# Altium schematic sheet D5035-01.SchDoc: Sheet Description
size A3; Organization: Organization; Address1: Address1; Address2: Address2; Address3: Address3; Address4: Address4; DocumentNumber: 1; Revision: 0; SheetNumber: 1; SheetTotal: 5; PageSetup: Record=PageOptions|CenterHorizontal=True|CenterVertical=True|PrintScale=1.00|XCorrection=1.00|YCorrection=1.00|PrintKind=1|BorderSize=5000000|LeftOffset=0|BottomOffset=0|Orientation=2|PaperLength=1000|PaperWidth=1000|Scale=100|PaperSource=7|PrintQuality=-4|MediaType=1|DitherType=10|PaperKind=A3|PrintScaleMode=0
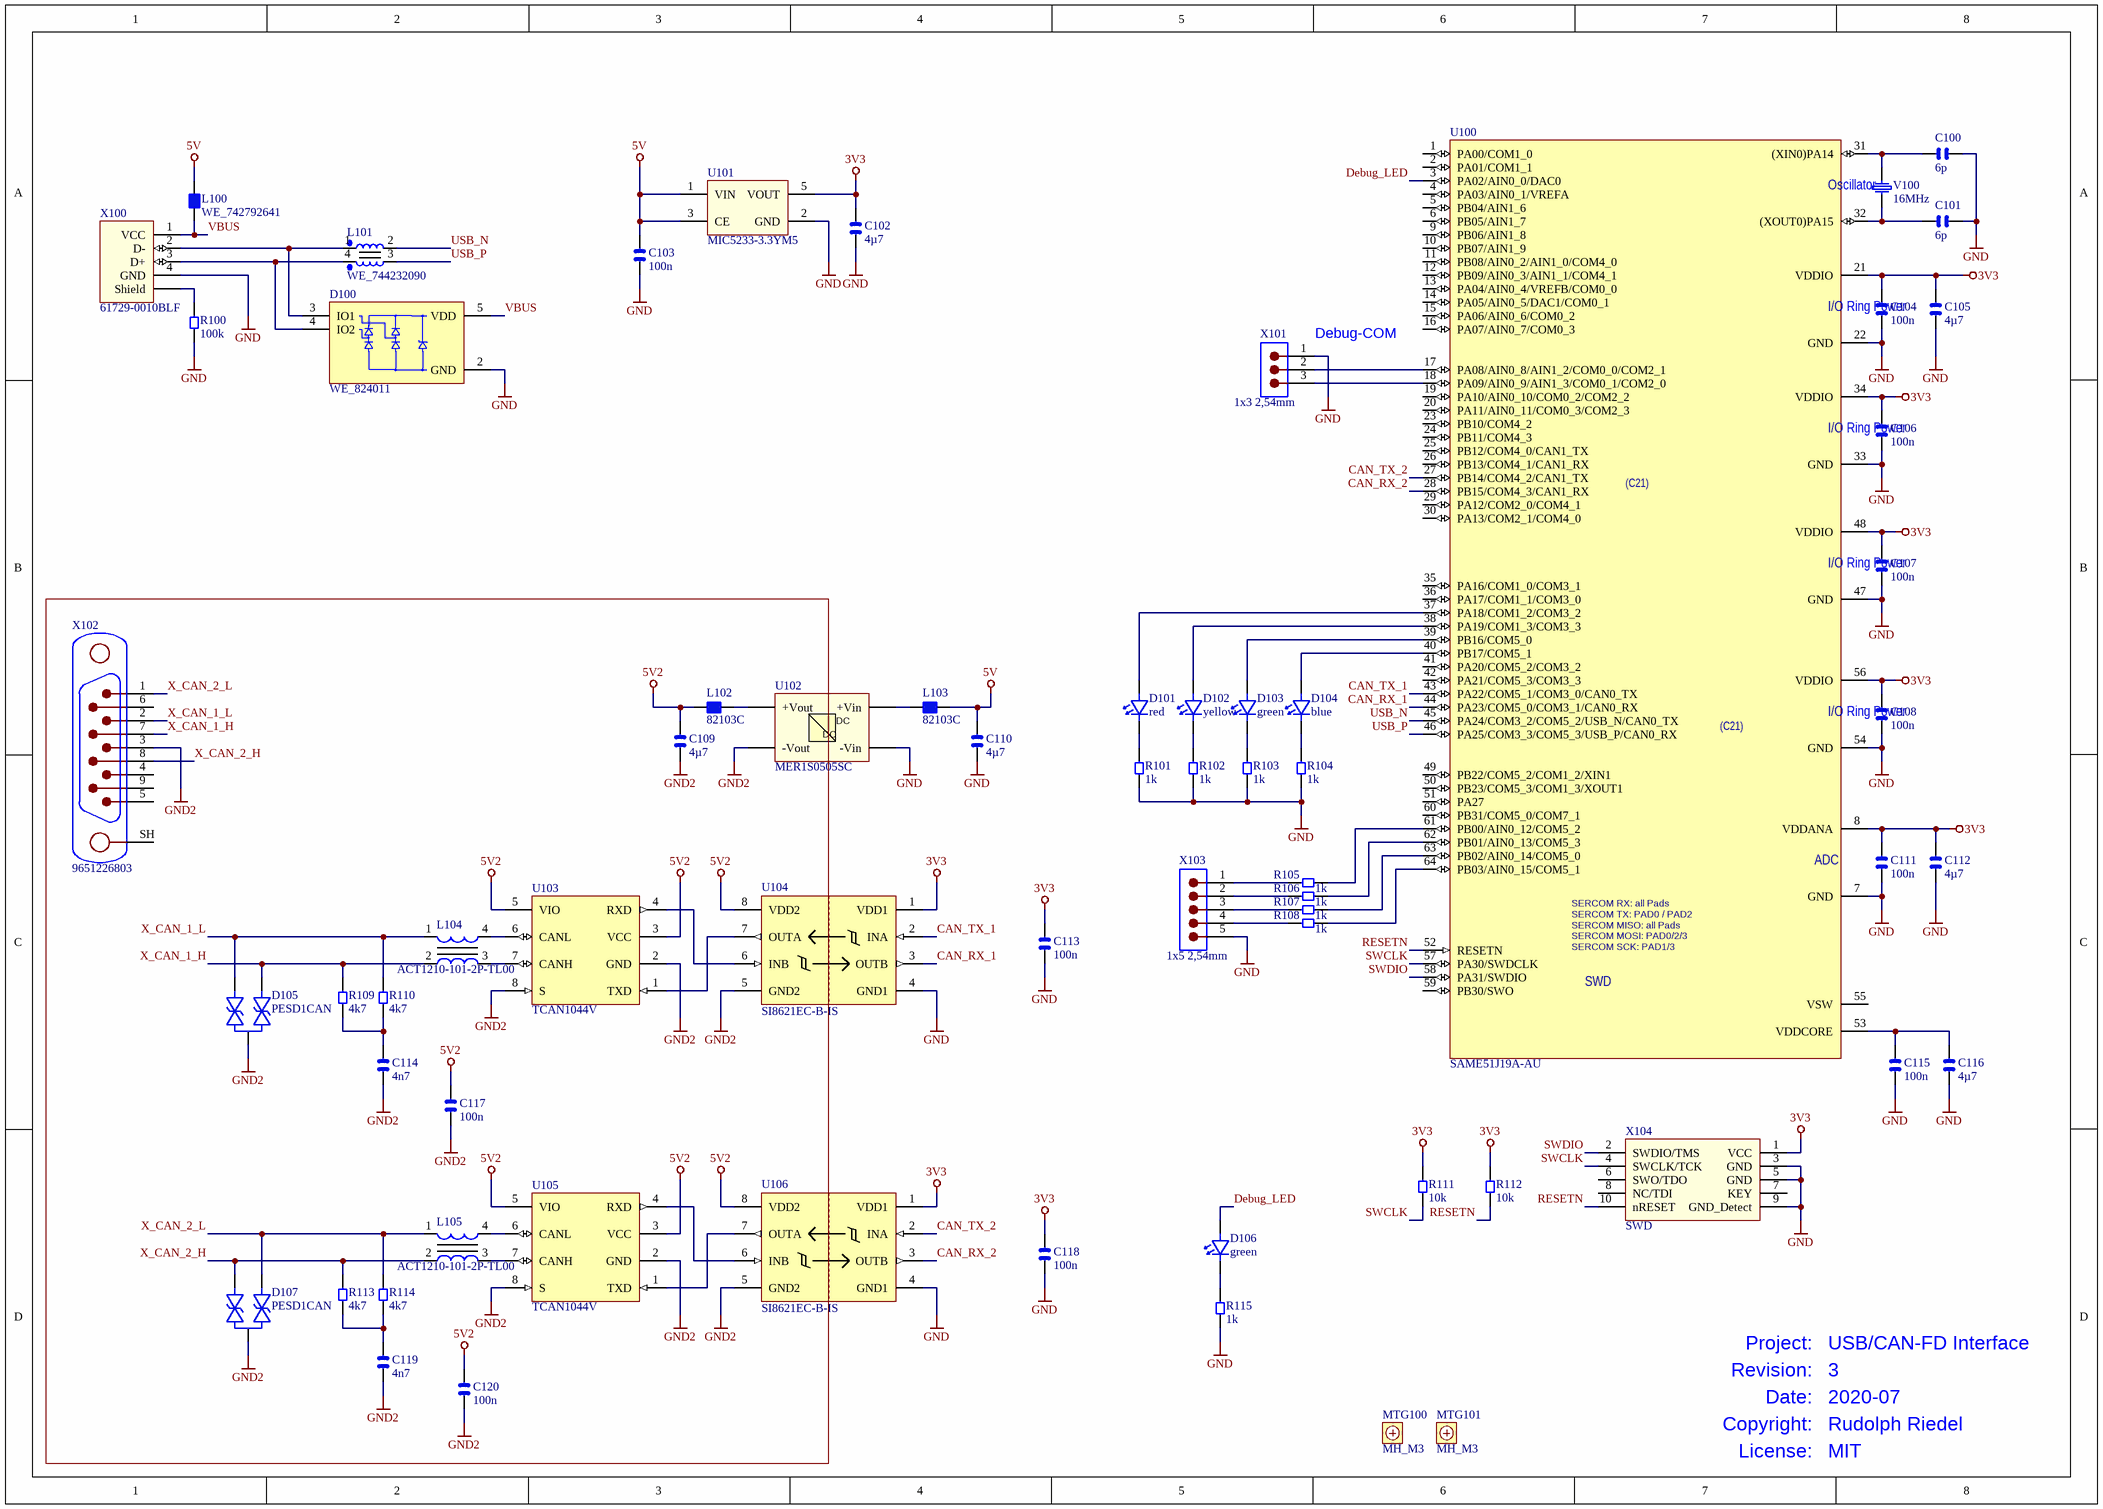
[diagram p0: D5035-01.SchDoc]

## Parts
C100  6p  [CAPC1608X09L]
C101  6p  [CAPC1608X09L]
C102  4µ7  [CAPC2012X14L]
C103  100n  [CAPC1608X09L]
C104  100n  [CAPC1608X09L]
C105  4µ7  [CAPC2012X14L]
C106  100n  [CAPC1608X09L]
C107  100n  [CAPC1608X09L]
C108  100n  [CAPC1608X09L]
C109  4µ7  [CAPC2012X14L]
C110  4µ7  [CAPC2012X14L]
C111  100n  [CAPC1608X09L]
C112  4µ7  [CAPC2012X14L]
C113  100n  [CAPC1608X09L]
C114  4n7  [CAPC2012X14L]
C115  100n  [CAPC1608X09L]
C116  4µ7  [CAPC2012X14L]
C117  100n  [CAPC1608X09L]
C118  100n  [CAPC1608X09L]
C119  4n7  [CAPC2012X14L]
C120  100n  [CAPC1608X09L]
D100  WE_824011  [SOT95P280X110-5N]
D101  red  [DIOC1608X06N_LED]
D102  yellow  [DIOC1608X06N_LED]
D103  green  [DIOC1608X06N_LED]
D104  blue  [DIOC1608X06N_LED]
D105  PESD1CAN  [SOT95P280X110-3N]
D106  green  [DIOC1608X06N_LED]
D107  PESD1CAN  [SOT95P280X110-3N]
L100  WE_742792641  [INDC1608X06L]
L101  WE_744232090  [WE_744232090]
L102  82103C  [Murata_8200C]
L103  82103C  [Murata_8200C]
L104  ACT1210-101-2P-TL00  [ACT1210]
L105  ACT1210-101-2P-TL00  [ACT1210]
MTG100  MH_M3  [HOLE_3_2MM]  (no BOM)
MTG101  MH_M3  [HOLE_3_2MM]  (no BOM)
R100  100k  [RESC2012X06L]
R101  1k  [RESC1608X06L]
R102  1k  [RESC1608X06L]
R103  1k  [RESC1608X06L]
R104  1k  [RESC1608X06L]
R105  1k  [RESC1608X06L]
R106  1k  [RESC1608X06L]
R107  1k  [RESC1608X06L]
R108  1k  [RESC1608X06L]
R109  4k7  [RESC2012X06L]
R110  4k7  [RESC2012X06L]
R111  10k  [RESC2012X06L]
R112  10k  [RESC2012X06L]
R113  4k7  [RESC2012X06L]
R114  4k7  [RESC2012X06L]
R115  1k  [RESC1608X06L]
U100  SAME51J19A-AU  [TSQFP50P1200X1200X120-64N]
U101  MIC5233-3.3YM5  [SOT95P280X110-5N]
U102  MER1S0505SC  [MER1SxxxxC]
U103  TCAN1044V  [SOT65P280X100-8N]
U104  SI8621EC-B-IS  [SOIC127P600X175-8N]
U105  TCAN1044V  [SOT65P280X100-8N]
U106  SI8621EC-B-IS  [SOIC127P600X175-8N]
V100  16MHz  [NX3225Gx]
X100  61729-0010BLF  [61729-xxxxxLF]
X101  1x3 2,54mm  [PINH_1x03_2_54mm]
X102  9651226803  [09651226803]
X103  1x5 2,54mm  [PINH_1x05_2_54mm]
X104  SWD  [FTSH-105-01-L-DV-K]

## Nets
3V3: C102.2 C104.2 C105.2 C106.2 C107.2 C108.2 C111.2 C112.2 C113.2 C118.2 R111.2 R112.2 U100.8(VDDANA) U100.21(VDDIO) U100.34(VDDIO) U100.48(VDDIO) U100.56(VDDIO) U101.5(VOUT) U104.1(VDD1) U106.1(VDD1) X104.1(VCC)
5V: C103.2 C110.2 L100.2 L103.1 U101.1(VIN) U101.3(CE)
5V2: C109.2 C117.2 C120.2 L102.2 U103.3(VCC) U103.5(VIO) U104.8(VDD2) U105.3(VCC) U105.5(VIO) U106.8(VDD2)
GND: C100.2 C101.2 C102.1 C103.1 C104.1 C105.1 C106.1 C107.1 C108.1 C110.1 C111.1 C112.1 C113.1 C115.1 C116.1 C118.1 D100.2(GND) R100.1 R101.1 R102.1 R103.1 R104.1 R115.1 U100.7(GND) U100.22(GND) U100.33(GND) U100.47(GND) U100.54(GND) U101.2(GND) U102.2(-Vin) U104.4(GND1) U106.4(GND1) X100.4(GND) X101.1 X103.5 X104.3(GND) X104.5(GND) X104.9(GND_Detect)
GND2: C109.1 C114.1 C117.1 C119.1 C120.1 D105.3 D107.3 U102.4(-Vout) U103.2(GND) U103.8(S) U104.5(GND2) U105.2(GND) U105.8(S) U106.5(GND2) X102.3
CAN_RX_1: U100.44(PA23/COM5_0/COM3_1/CAN0_RX) U104.3(OUTB)
CAN_RX_2: U100.28(PB15/COM4_3/CAN1_RX) U106.3(OUTB)
CAN_TX_1: U100.43(PA22/COM5_1/COM3_0/CAN0_TX) U104.2(INA)
CAN_TX_2: U100.27(PB14/COM4_2/CAN1_TX) U106.2(INA)
Debug_LED: D106.2 U100.3(PA02/AIN0_0/DAC0)
RESETN: R112.1 U100.52(RESETN) X104.10(nRESET)
SWCLK: R111.1 U100.57(PA30/SWDCLK) X104.4(SWCLK/TCK)
SWDIO: U100.58(PA31/SWDIO) X104.2(SWDIO/TMS)
USB_N: L101.2 U100.45(PA24/COM3_2/COM5_2/USB_N/CAN0_TX)
USB_P: L101.3 U100.46(PA25/COM3_3/COM5_3/USB_P/CAN0_RX)
VBUS: D100.5(VDD) L100.1 X100.1(VCC)
X_CAN_1_H: D105.2 L104.2 R109.2 X102.7
X_CAN_1_L: D105.1 L104.1 R110.2 X102.2
X_CAN_2_H: D107.1 L105.2 R113.2 X102.8
X_CAN_2_L: D107.2 L105.1 R114.2 X102.1
NetC100_1: C100.1 U100.31((XIN0)PA14) V100.2
NetC101_1: C101.1 U100.32((XOUT0)PA15) V100.1
NetC114_2: C114.2 R109.1 R110.1
NetC115_2: C115.2 C116.2 U100.53(VDDCORE)
NetC119_2: C119.2 R113.1 R114.1
NetD100_3: D100.3(IO1) L101.1 X100.2(D-)
NetD100_4: D100.4(IO2) L101.4 X100.3(D+)
NetD101_1: D101.1 R101.2
NetD101_2: D101.2 U100.37(PA18/COM1_2/COM3_2)
NetD102_1: D102.1 R102.2
NetD102_2: D102.2 U100.38(PA19/COM1_3/COM3_3)
NetD103_1: D103.1 R103.2
NetD103_2: D103.2 U100.39(PB16/COM5_0)
NetD104_1: D104.1 R104.2
NetD104_2: D104.2 U100.40(PB17/COM5_1)
NetD106_1: D106.1 R115.2
NetL102_1: L102.1 U102.6(+Vout)
NetL103_2: L103.2 U102.1(+Vin)
NetL104_3: L104.3 U103.7(CANH)
NetL104_4: L104.4 U103.6(CANL)
NetL105_3: L105.3 U105.7(CANH)
NetL105_4: L105.4 U105.6(CANL)
NetR100_2: R100.2 X100.Shell(Shield)
NetR105_1: R105.1 X103.1
NetR105_2: R105.2 U100.61(PB00/AIN0_12/COM5_2)
NetR106_1: R106.1 X103.2
NetR106_2: R106.2 U100.62(PB01/AIN0_13/COM5_3)
NetR107_1: R107.1 X103.3
NetR107_2: R107.2 U100.63(PB02/AIN0_14/COM5_0)
NetR108_1: R108.1 X103.4
NetR108_2: R108.2 U100.64(PB03/AIN0_15/COM5_1)
NetU100_17: U100.17(PA08/AIN0_8/AIN1_2/COM0_0/COM2_1) X101.2
NetU100_18: U100.18(PA09/AIN0_9/AIN1_3/COM0_1/COM2_0) X101.3
NetU103_1: U103.1(TXD) U104.7(OUTA)
NetU103_4: U103.4(RXD) U104.6(INB)
NetU105_1: U105.1(TXD) U106.7(OUTA)
NetU105_4: U105.4(RXD) U106.6(INB)

Not connected (* = marked no-connect by the designer): U100 1(PA00/COM1_0) 2(PA01/COM1_1) 4(PA03/AIN0_1/VREFA) 5(PB04/AIN1_6) 6(PB05/AIN1_7) 9(PB06/AIN1_8) 10(PB07/AIN1_9) 11(PB08/AIN0_2/AIN1_0/COM4_0) 12(PB09/AIN0_3/AIN1_1/COM4_1) 13(PA04/AIN0_4/VREFB/COM0_0) 14(PA05/AIN0_5/DAC1/COM0_1) 15(PA06/AIN0_6/COM0_2) 16(PA07/AIN0_7/COM0_3) 19(PA10/AIN0_10/COM0_2/COM2_2) 20(PA11/AIN0_11/COM0_3/COM2_3) 23(PB10/COM4_2) 24(PB11/COM4_3) 25(PB12/COM4_0/CAN1_TX) 26(PB13/COM4_1/CAN1_RX) 29(PA12/COM2_0/COM4_1) 30(PA13/COM2_1/COM4_0) 35(PA16/COM1_0/COM3_1) 36(PA17/COM1_1/COM3_0) 41(PA20/COM5_2/COM3_2) 42(PA21/COM5_3/COM3_3) 49(PB22/COM5_2/COM1_2/XIN1) 50(PB23/COM5_3/COM1_3/XOUT1) 51(PA27) 55(VSW) 59(PB30/SWO) 60(PB31/COM5_0/COM7_1); X102 4 5 6 9 SH; X104 6(SWO/TDO) 7(KEY) 8(NC/TDI)

## Notes on the sheet
- (near X101) Debug-COM
- Project:
- Revision:
- USB/CAN-FD Interface
- 3
- Date:
- Copyright:
- License:
- 2020-07
- Rudolph Riedel
- MIT
- A3_base_en_02.005
- Title:
- PCBA:
- Project Leader:
- Schematic State:
- IAV-PCBA:
- Cust.PCBA:
- IAV-
- -
- Editor:
- Variant:
- Variant State:
- Edited:
- Printed:
- Document:
- ©
- File:
- Page:
- of
- (in symbol MER1S0505SC) DC
- (in symbol SAME51J19A-AU) Oscillator; I/O Ring Power; (C21); ADC; SERCOM RX: all Pads / SERCOM TX: PAD0 / PAD2 / SERCOM MISO: all Pads / SERCOM MOSI: PAD0/2/3 / SERCOM SCK: PAD1/3; SWD

## Library data of the parts
C100 C101 C103 C104 C106-C108 C111 C113 C115 C117 C118 C120 = CAPC_0603: 0603 Chip Capacitor; Editor: rriedel; Kategorie: generic; Unterart: unpolarized; Part Number: CAPC_0603; Status: tested; Bauteilart: Capacitor; PackageDescription: 0603
  C100 C101: Value: 6p
  C103 C104 C106-C108 C111 C113 C115 C117 C118 C120: Value: 100n
C102 C105 C109 C110 C112 C114 C116 C119 = CAPC_0805: 0805 Chip Capacitor; Editor: rriedel; Kategorie: generic; Unterart: unpolarized; Part Number: CAPC_0805; Status: tested; Bauteilart: Capacitor; PackageDescription: 0805
  C102 C105 C109 C110 C112 C116: Value: 4µ7
  C114 C119: Value: 4n7
D100 = WE_824011: TVS Diode Array WE-TVS; Manufacturer: Wuerth; Part_Number_1: 824011; Editor: rriedel; Kategorie: Part; Unterart: ESD; Part Number: WE_824011; Value: WE_824011; Status: new; Date: 22.06.2020; Bauteilart: Diode; PackageDescription: SOT23-5; Distributor_1: Digi-Key; Distributor_1_Part_Number: 732-4465-1-ND
D101-D104 D106 = LED_0603: LED, 0603; Editor: rriedel; Kategorie: generic; Bauteilart: Diode; Part Number: LED_0603; Status: new; Date: 29.06.2020; Unterart: generic; PackageDescription: 0603
  D101: Value: red
  D102: Value: yellow
  D103 D106: Value: green
  D104: Value: blue
D105 D107 = PESD1CAN: CAN bus ESD protection diode; Manufacturer: Nexperia; Editor: rriedel; Kategorie: Part; Unterart: Transil; Part Number: PESD1CAN; Value: PESD1CAN; Status: new; Date: 27.06.2020; Bauteilart: Diode; PackageDescription: SOT23; Part_Number_1: PESD1CAN; Distributor_1: Digi-Key; Distributor_1_Part_Number: 1727-3817-1-ND
L100 = WE_742792641: SMT EMI suppression ferrite bead WE-CBF; Manufacturer: Wuerth; Editor: rriedel; Kategorie: Part; Bauteilart: Inductor; Part Number: WE_742792641; Value: WE_742792641; Status: new; Date: 22.06.2020; Unterart: Ferrite Bead; PackageDescription: 0603; Part_Number_1: 742792641; Distributor_1: Digi-Key; Distributor_1_Part_Number: 732-1592-1-ND
L101 = WE_744232090: SMD common mode noise suppressor WE-CNSW; Manufacturer: Wuerth; Editor: rriedel; Kategorie: Part; Bauteilart: Inductor; Unterart: Filter; Part Number: WE_744232090; Value: WE_744232090; Status: new; Date: 22.06.2020; PackageDescription: 3216; Part_Number_1: 744232090; Distributor_1: Digi-Key; Distributor_1_Part_Number: 732-1469-1-ND
L102 L103 = 82103C: 10µH, 0,5A, 400mR; Manufacturer: Murata; Editor: rriedel; Kategorie: Part; Bauteilart: Inductor; Unterart: Power; Part Number: 82103C; Value: 82103C; Status: new; Date: 27.06.2020; PackageDescription: 3,2x2,5 mm; Part_Number_1: 82103C; Distributor_1: Digi-Key; Distributor_1_Part_Number: 811-2473-1-ND
L104 L105 = ACT1210-101-2P-TL00: Common Mode Filter,  -50°C ... +150°C, AEC-Q200; Manufacturer: TDK; Editor: rriedel; Kategorie: Part; Bauteilart: Inductor; Part Number: ACT1210-101-2P-TL00; Value: ACT1210-101-2P-TL00; Status: tested; Date: 17.10.2017; Unterart: Filter; PackageDescription: 3225; Part_Number_1: ACT1210-101-2P-TL00; Distributor_1: Farnell; Distributor_1_Part_Number: 2442838; Distributor_2: Digi-Key; Distributor_2_Part_Number: 445-172386-1-ND
MTG100 MTG101 = MH_M3: Mounting-Hole for M3 screws; Editor: rriedel; Kategorie: No_Bom; Bauteilart: Mechanic; Unterart: Holes; Part Number: MH_M3; Value: MH_M3; Status: tested; Date: 13.05.2018
R100 R109-R114 = RESC_0805: 0805 Chip Resistor; Editor: rriedel; Kategorie: generic; Part Number: RESC_0805; Status: tested; Bauteilart: Resistor; Unterart: generic; PackageDescription: 0805
  R100: Value: 100k
  R109 R110 R113 R114: Value: 4k7
  R111 R112: Value: 10k
R101-R108 R115 = RESC_0603: 0603 Chip Resistor; Editor: rriedel; Kategorie: generic; Part Number: RESC_0603; Value: 1k; Status: tested; Bauteilart: Resistor; Unterart: generic; PackageDescription: 0603
U100 = SAME51J19A-AU: 32-bit Microcontroller, 120MHz Cortex M4-F, 512k FLASH,  2x CAN-FD, -40…85°C; Manufacturer: Microchip; Editor: rriedel; Kategorie: Part; Bauteilart: MikroController; Unterart: 32bit Microchip; Part Number: SAME51J19A-AU; Value: SAME51J19A-AU; Status: tested; Date: 15.07.2018; PackageDescription: TQFP64-0.5mm; Part_Number_1: SAME51J19A-AU; Distributor_1: Digi-Key; Distributor_1_Part_Number: ATSAME51J19A-AUTCT-ND
U101 = MIC5233-3.3: 100 mA LDO,  Vout= 3,3V, -40°C..125°C; Manufacturer: Microchip; Editor: rriedel; Kategorie: Part; Bauteilart: IC; Unterart: Linear-Regulators; ComponenLinkDescription: Datasheet; ComponenLinkURL: D:\Altium_lib_HW-Labor_GF\Altium_lib\Datenblaetter\pcb\Integrierte Schaltkreise\Microchip\mic5233.pdf; Part Number: MIC5233-3.3; Value: MIC5233-3.3YM5; Status: tested; Date: 15.09.2016; PackageDescription: SOT23-5; Part_Number_1: MIC5233-3.3YM5; Distributor_1: Farnell; Distributor_1_Part_Number: 2510274
U102 = MER1S0505SC: Isolated 1W Single Output DC-DC Converters 5V/5V 200mA; Manufacturer: Murata; Editor: rriedel; Kategorie: Part; Bauteilart: Module; Unterart: DCDC; Part Number: MER1S0505SC; Value: MER1S0505SC; Status: new; Date: 27.06.2020; PackageDescription: 4Pin SIP; Part_Number_1: MER1S0505SC; Distributor_1: Digi-Key; Distributor_1_Part_Number: 811-2124-5-ND‎
U103 U105 = TCAN1044V: CAN-FD transceiver 8MBit, VIO Pin; Manufacturer: TI; Part_Number_1: TCAN1044VDDFR; Editor: rriedel; Kategorie: Part; Bauteilart: IC; Unterart: CAN; Part Number: TCAN1044V; Value: TCAN1044V; Status: new; Date: 28.06.2020; PackageDescription: SOT23-8; Distributor_1: Digi-Key; Distributor_1_Part_Number: 296-TCAN1044VDDFRCT-ND
U104 U106 = SI8621EC-B-IS: Dual channel digital isolator, 150Mbit, 3,75kV; Manufacturer: Silicon Labs; Editor: rriedel; Kategorie: Part; Bauteilart: IC; Part Number: SI8621EC-B-IS; Value: SI8621EC-B-IS; Status: new; Date: 29.06.2020; Unterart: Isolator; PackageDescription: SO8; Part_Number_1: SI8621EC-B-IS; Distributor_1: Digi-Key; Distributor_1_Part_Number: 336-4776-1-ND
V100 = NX3225GB-16.000000MHZ: 16.000MHz Crystal SMD, 3.2x2.5mm, 8pF, 50ppm,  -40..+150°C; Manufacturer: NDK; Part_Number_1: NX3225GB-16M-STD-CRA-2; Editor: rriedel; Kategorie: Part; Unterart: NX3225GB automotive; Part Number: NX3225GB-16.000000MHZ; Value: 16MHz; Status: tested; Date: 22.10.2015; Bauteilart: Crystal; PackageDescription: NX3225Gx 3,2mm x 2,5mm; Distributor_1: Digi-Key; Distributor_1_Part_Number: 644-1233-1-ND; Distributor_2: Frischer
X100 = 61729-0010BLF: USB-B socket, THT; Manufacturer: Amphenol; Editor: rriedel; Kategorie: Part; Bauteilart: Connector; Part Number: 61729-0010BLF; Value: 61729-0010BLF; Status: new; Date: 28.06.2020; Unterart: USB; PackageDescription: USB-B; Part_Number_1: 61729-0010BLF; Distributor_1: Digi-Key; Distributor_1_Part_Number: 609-1039-ND
X101 = PINH_1x3_2_54: Pin-Header 2,54 mm 3pins; Editor: rriedel; Kategorie: generic; Bauteilart: Connector; Part Number: PINH_1x3_2_54; Value: 1x3 2,54mm; Status: tested; Date: 02.02.2017; Unterart: Pin-Header
X102 = 9651226803: D-Sub, 9 pin, male, right angle; Manufacturer: Harting; Editor: rriedel; Kategorie: Part; Bauteilart: Connector; Part Number: 9651226803; Value: 9651226803; Status: new; Date: 29.06.2020; Unterart: D-Sub; PackageDescription: D-Sub; Part_Number_1: 9651226803; Distributor_1: Farnell; Distributor_1_Part_Number: 2752007
X103 = PINH_1x5_2_54: Pin-Header 2,54 mm 5pins; Editor: rriedel; Kategorie: generic; Bauteilart: Connector; Part Number: PINH_1x5_2_54; Value: 1x5 2,54mm; Status: tested; Date: 20.06.2017; Unterart: Pin-Header
X104 = SWD: ARM Debug-Header 2x5 1,27 mm; Editor: rriedel; Kategorie: Part; Bauteilart: Connector; Unterart: Debug; Part Number: SWD; Value: SWD; Status: tested; Date: 12.08.2018; PackageDescription: 2x5 1,27mm